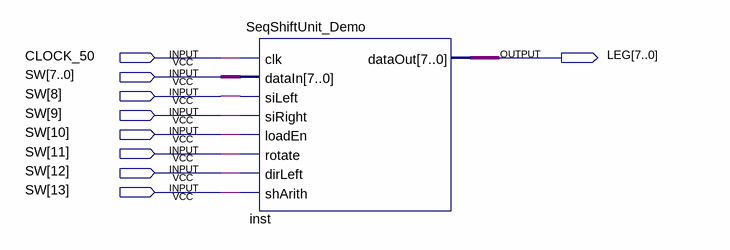
[diagram p0: schematic sheet]
// Quartus schematic SeqShiftUnit_Dem.bdf as structural Verilog: 1 symbols, 9 pins
module SeqShiftUnit_Dem (
  input  CLOCK_50,
  input  [13:0] SW,
  output [7:0] LEG
);

  SeqShiftUnit_Demo inst (
    .clk(CLOCK_50), .dataIn(SW[7:0]), .siLeft(SW[8]), .siRight(SW[9]), .loadEn(SW[10]), .rotate(SW[11]),
    .dirLeft(SW[12]), .shArith(SW[13]), .dataOut(LEG));
endmodule
